# EasyEDA schematic wateralrm.json
TITLE: Sheet_1; REV: 1.0; Date: 2025-06-28; Sheet: 1/1; Drawn By: sanji_17; Company: Your Company
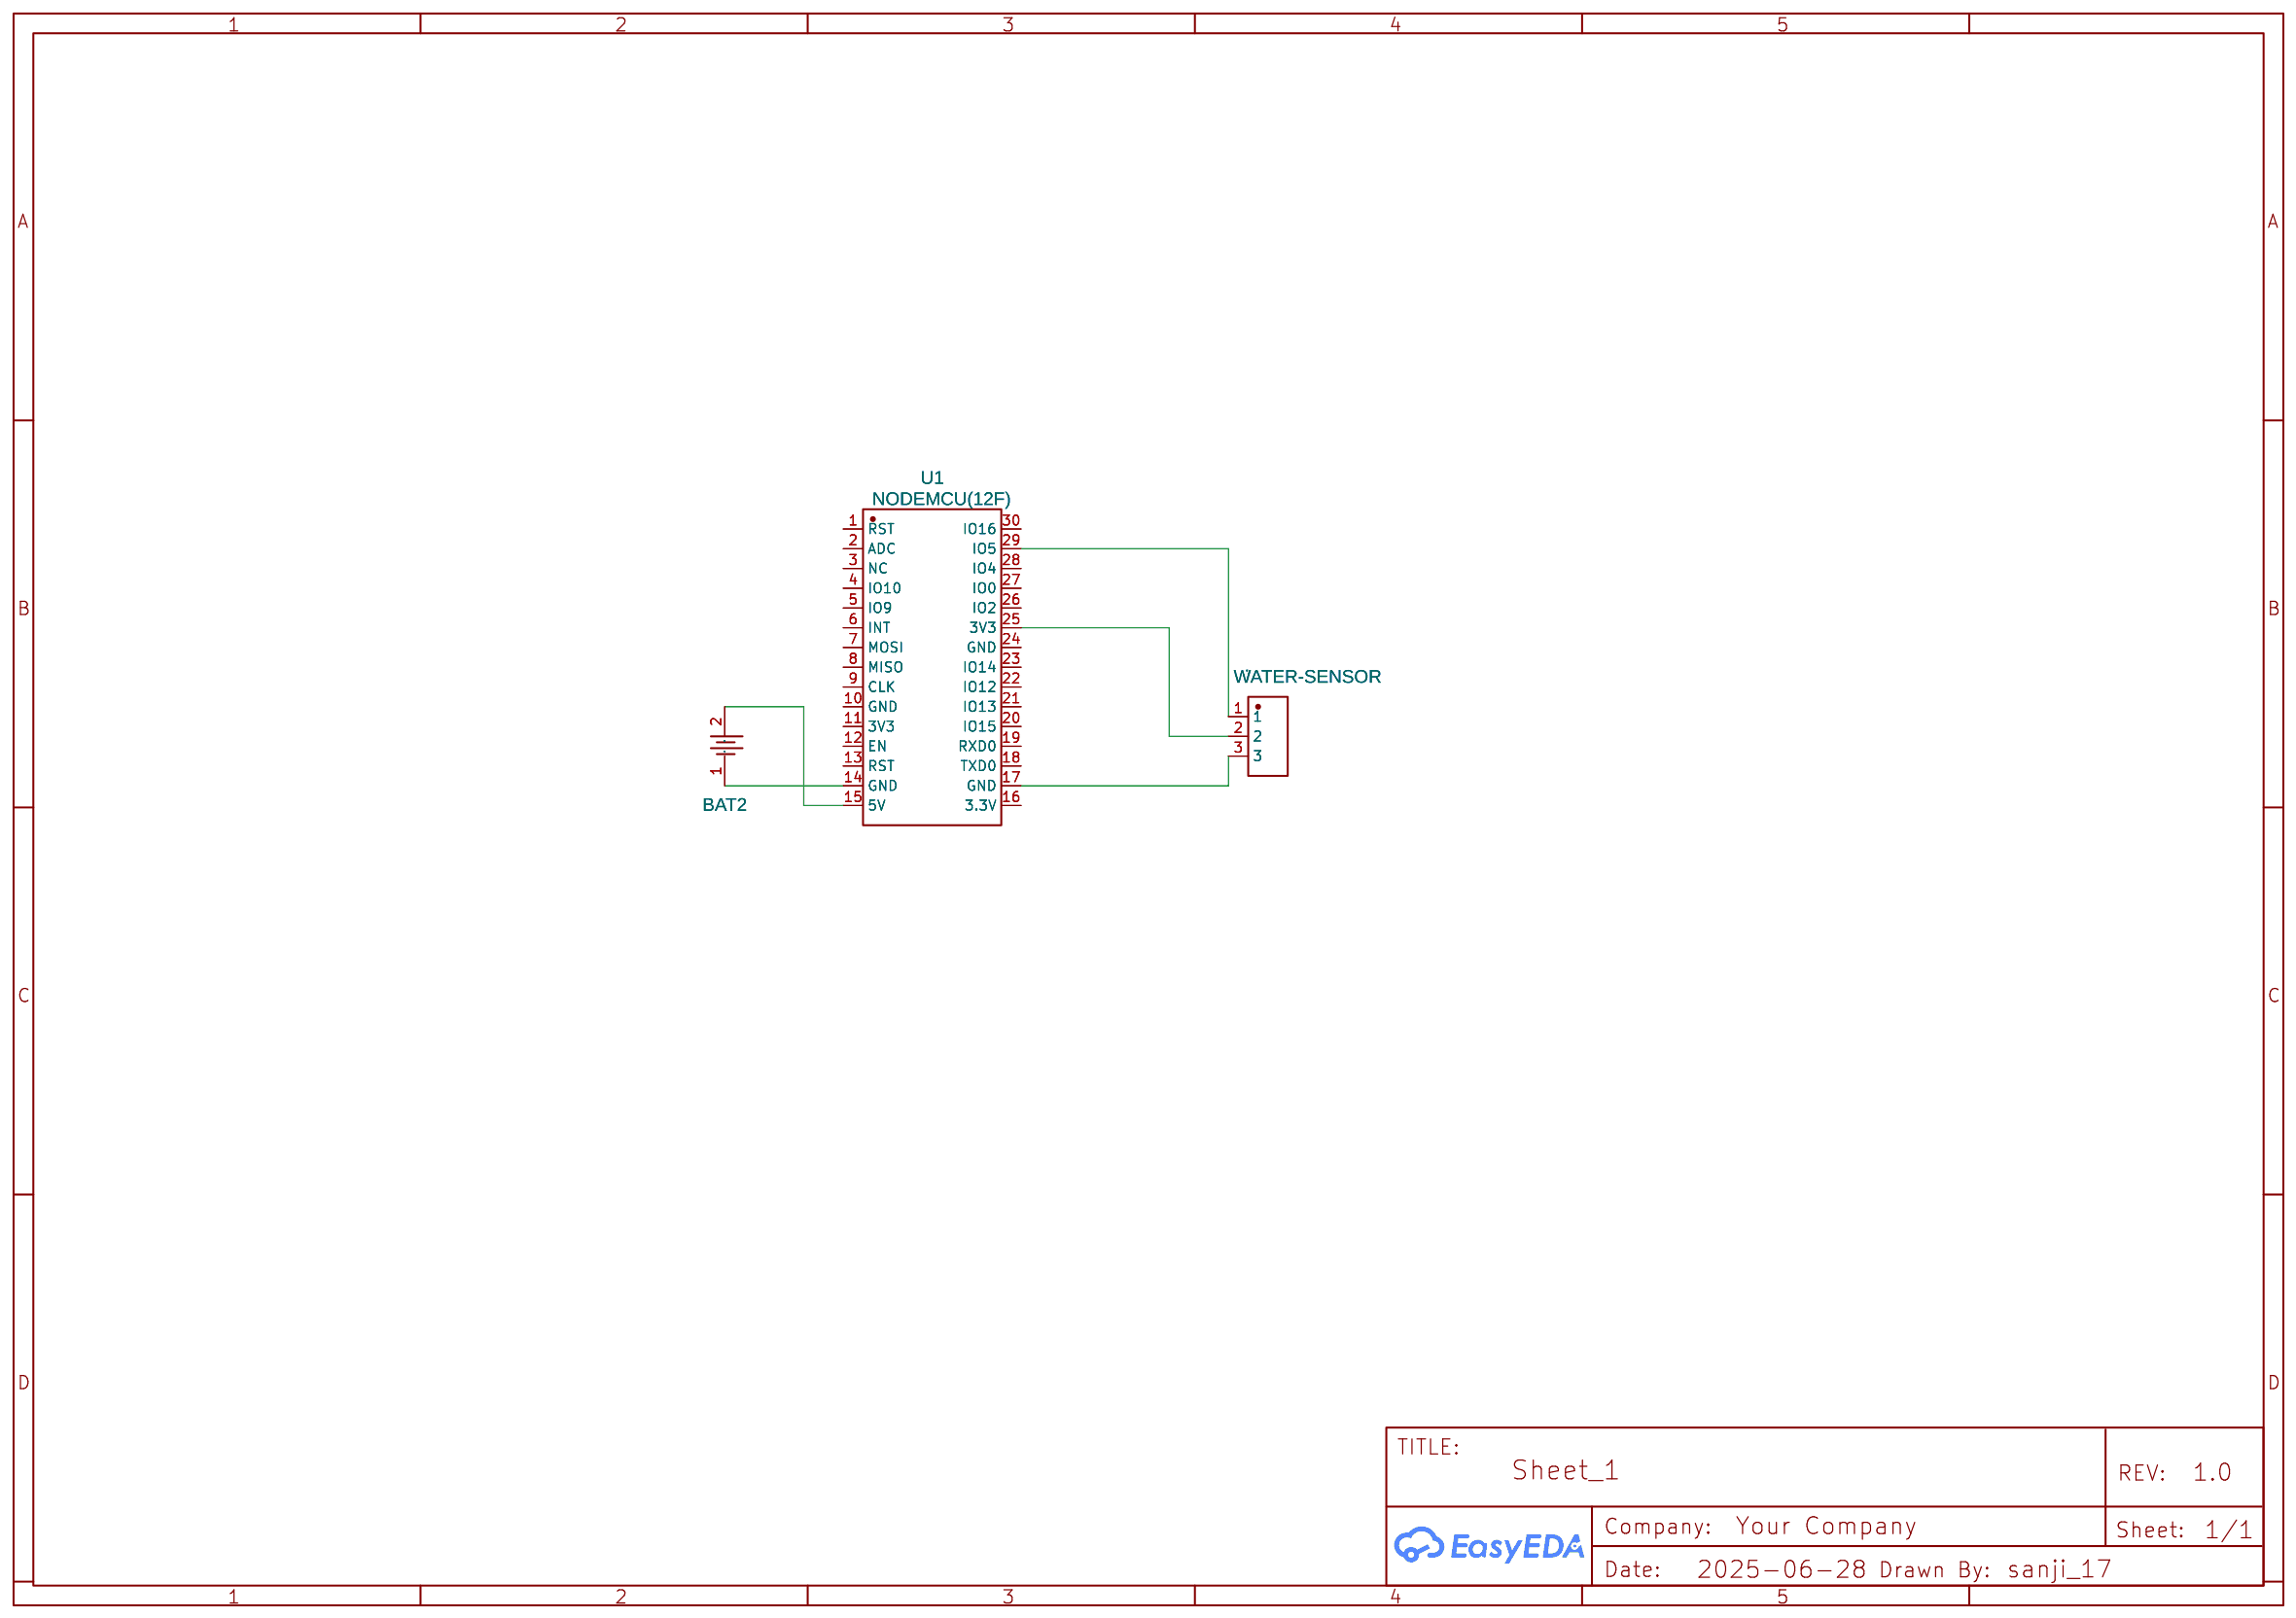
[diagram p0: schematic sheet]

## Parts
.  WATER-SENSOR  [CONN-TH_HX-PZ2.54-1X3P-ZZ]
BAT2  BH-18650-B6AA002  [BATTERY-SMD_18650-1S-L77.1-W20.7-1]
U1  NODEMCU(12F)  [WIFIM-TH_NODEMCU-8266]

## Library data of the parts
. = HX PZ2.54-1X3P ZZ: Supplier: LCSC; Supplier Part: C32713269; Manufacturer: hanxia(韩下); Manufacturer Part: HX PZ2.54-1x3P ZZ; JLCPCB Part Class: Extended Part; Contributor: lcsc
BAT2 = BH-18650-B6AA002: Supplier: LCSC; Supplier Part: C7525438; Manufacturer: MYOUNG(美阳); Contributor: lcsc; JLCPCB Part Class: Extended Part
U1 = NODEMCU(12F): Supplier: LCSC; Supplier Part: C2764098; Manufacturer: Ai-Thinker(安信可); Contributor: lcsc; JLCPCB Part Class: Extended Part

## Nets
Net-(.-1): ..1 U1.29(IO5)
Net-(.-2): ..2 U1.25(3V3)
Net-(.-3): ..3 U1.17(GND)
Net-(BAT2-1): BAT2.1 U1.14(GND)
Net-(BAT2-2): BAT2.2 U1.15(5V)

Not connected (* = marked no-connect by the designer): U1 1(RST) 2(ADC) 3(NC) 4(IO10) 5(IO9) 6(INT) 7(MOSI) 8(MISO) 9(CLK) 10(GND) 11(3V3) 12(EN) 13(RST) 16(3.3V) 18(TXD0) 19(RXD0) 20(IO15) 21(IO13) 22(IO12) 23(IO14) 24(GND) 26(IO2) 27(IO0) 28(IO4) 30(IO16)
